# Altium project ecen303project.PrjPCB
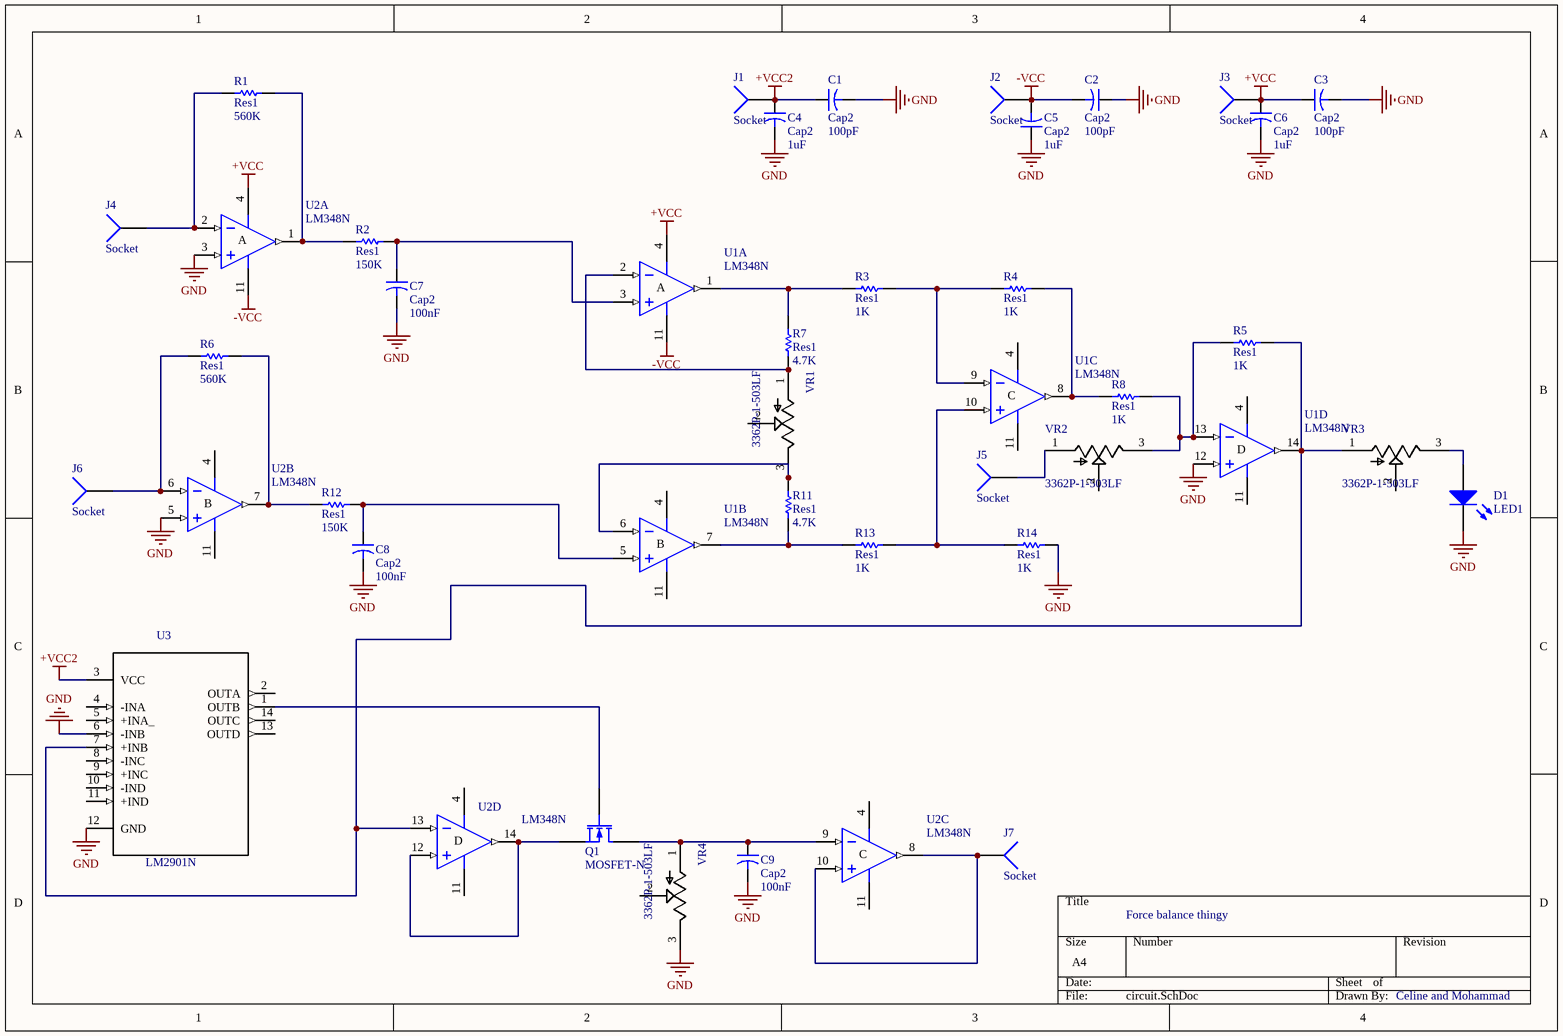
[diagram p0: circuit.SchDoc]
1 sheet, 37 parts. Net scope: global (net labels, ports and power ports of the same name join across sheets).
Board file: PCB.PcbDoc

## Sheet circuit.SchDoc
size A4

### Parts
C1  Cap2  value 100pF  [CAPR5-4X5]
C2  Cap2  value 100pF  [CAPR5-4X5]
C3  Cap2  value 100pF  [CAPR5-4X5]
C4  Cap2  value 1uF  [CAPR5-4X5]
C5  Cap2  value 1uF  [CAPR5-4X5]
C6  Cap2  value 1uF  [CAPR5-4X5]
C7  Cap2  value 100nF  [CAPR5-4X5]
C8  Cap2  value 100nF  [CAPR5-4X5]
C9  Cap2  value 100nF  [CAPR5-4X5]
D1  LED1  [LED-1]
J1  Socket  [PIN1]
J2  Socket  [PIN1]
J3  Socket  [PIN1]
J4  Socket  [PIN1]
J5  Socket  [PIN1]
J6  Socket  [PIN1]
J7  Socket  [PIN1]
Q1  MOSFET-N  [E3]
R1  Res1  value 560K  [AXIAL-0.3]
R2  Res1  value 150K  [AXIAL-0.3]
R3  Res1  value 1K  [AXIAL-0.3]
R4  Res1  value 1K  [AXIAL-0.3]
R5  Res1  value 1K  [AXIAL-0.3]
R6  Res1  value 560K  [AXIAL-0.3]
R7  Res1  value 4.7K  [AXIAL-0.3]
R8  Res1  value 1K  [AXIAL-0.3]
R11  Res1  value 4.7K  [AXIAL-0.3]
R12  Res1  value 150K  [AXIAL-0.3]
R13  Res1  value 1K  [AXIAL-0.3]
R14  Res1  value 1K  [AXIAL-0.3]
U1  LM348N  [N014]  (parts A,B,C,D of 4)
U2  LM348N  [N014]  (parts A,B,C,D of 4)
U3  LM2901N  [*DIP254P762X508-14]
VR1  3362P-1-503LF  [*TRIM_3362P-1-503LF]
VR2  3362P-1-503LF  [*TRIM_3362P-1-503LF]
VR3  3362P-1-503LF  [*TRIM_3362P-1-503LF]
VR4  3362P-1-503LF  [*TRIM_3362P-1-503LF]

### Nets
+VCC: C3.1 C6.1 J3.1 U1.4(V+) U2.4(V+)
+VCC2: C1.1 C4.1 J1.1 U3.3(VCC)
-VCC: C2.2 C5.2 J2.1 U1.11(V-) U2.11(V-)
GND: C1.2 C2.1 C3.2 C4.2 C5.1 C6.2 C7.2 C8.2 C9.2 D1.2(K) R14.2 U1.12(IN+) U2.3(IN+) U2.5(IN+) U3.6(-INB) U3.12(GND) VR4.3(CW)
NetC7_1: C7.1 R2.2 U1.3(IN+)
NetC8_1: C8.1 R12.2 U1.5(IN+)
NetC9_1: C9.1 Q1.1(D) U2.9(IN-) VR4.1(CCW)
NetD1_1: D1.1(A) VR3.3(CW)
NetJ4_1: J4.1 R1.1 U2.2(IN-)
NetJ5_1: J5.1 VR2.1(CCW)
NetJ6_1: J6.1 R6.1 U2.6(IN-)
NetJ7_1: J7.1 U2.8(OUT) U2.10(IN+)
NetQ1_2: Q1.2(G) U3.1(OUTB)
NetQ1_3: Q1.3(S) U2.12(IN+) U2.14(OUT)
NetR1_2: R1.2 R2.1 U2.1(OUT)
NetR3_1: R3.1 R7.2 U1.1(OUT)
NetR3_2: R3.2 R4.1 U1.9(IN-)
NetR4_2: R4.2 R8.1 U1.8(OUT)
NetR5_1: R5.1 R8.2 U1.13(IN-) VR2.3(CW)
NetR5_2: R5.2 U1.14(OUT) U2.13(IN-) U3.7(+INB) VR3.1(CCW)
NetR6_2: R6.2 R12.1 U2.7(OUT)
NetR7_1: R7.1 U1.2(IN-) VR1.1(CCW)
NetR11_1: R11.1 R13.1 U1.7(OUT)
NetR11_2: R11.2 U1.6(IN-) VR1.3(CW)
NetR13_2: R13.2 R14.1 U1.10(IN+)

Not connected (* = marked no-connect by the designer): U3 2(OUTA) 4(-INA) 5(+INA_) 8(-INC) 9(+INC) 10(-IND) 11(+IND) 13(OUTD) 14(OUTC); VR1 2(WIPER); VR2 2(WIPER); VR3 2(WIPER); VR4 2(WIPER)

### Notes on the sheet
- Force balance thingy
- Celine and Mohammad
- (in symbol LM348N, part A) A
- (in symbol LM348N, part B) B
- (in symbol LM348N, part C) C
- (in symbol LM348N, part D) D

### Library data of the parts
C1-C9 = Cap2: Capacitor; Published: 23-Sep-2002; PackageReference: CAPR5-4X5; Publisher: Altium Limited; PackageDescription: Capacitor; 2 Leads
D1 = LED1: Typical RED GaAs LED; Published: 8-Jun-2000; LatestRevisionDate: 08-Jul-2005; LatestRevisionNote: Mech Layer 1 removed.; PackageReference: LED-1; Publisher: Altium Limited; PackageDescription: LED; 2 Leads
Q1 = MOSFET-N: N-Channel MOSFET; Published: 8-Jun-2000; LatestRevisionDate: 17-Jul-2002; LatestRevisionNote: Re-released for DXP Platform.; PackageVersion: 1995/1996; PackageReference: E3; Publisher: Altium Limited; PackageDescription: TO, Flat Index; 3 In-Line, Axial Leads; Body Dia. 4.6mm; Lead Dia. 0.5 mm (max)
R1-R8 R11-R14 = Res1: Resistor; Published: 8-Jun-2000; LatestRevisionDate: 17-Jul-2002; LatestRevisionNote: Re-released for DXP Platform.; PackageReference: AXIAL-0.3; Publisher: Altium Limited; PackageDescription: Axial Device, Thru-Hole; 2 Leads; 0.3 in Pin Spacing
U1 U2 = LM348N: Quadruple Operational Amplifier; Published: 16-Jan-2001; LatestRevisionDate: 04-Mar-2005; LatestRevisionNote: Stylized 3D Model Added.; DatasheetVersion: Aug-1996; PackageVersion: Oct-1995; PackageReference: N014; Publisher: Altium Limited; PackageDescription: DIP; 14 Leads; Row Spacing 7.62 mm; Pitch 2.54 mm; ComponentLink1Description: Manufacturer Link; ComponentLink1URL: http://www.ti.com/; ComponentLink2Description: Datasheet; ComponentLink2URL: http://www-s.ti.com/sc/ds/lm348.pdf
U3 = LM2901N: Low Power Low Offset Voltage Quad Comparator 14-PDIP -40 to 85; MF: Texas Instruments; MP: LM2901N/NOPB; Price: None; Package: PDIP-14 Texas Instruments; SnapEDA_Link: https://www.snapeda.com/parts/LM2901N/NOPB/Texas%20Instruments/view-part/?ref=snap; Availability: Unavailable; Value: *
VR1-VR4 = 3362P-1-503LF: Res Cermet Trimmer 50K Ohm 10% 1/2W 1_Elec_/1_Mech_Turn 2.77mm _6.6 X 6.99 X 4.7mm_ Pin Thru-Hole Tube; MF: Bourns; SnapEDA_Link: https://www.snapeda.com/parts/3362P-1-503LF/Bourns%20-%20J.W.%20Miller/view-part/?ref=snap; Digi-Key_Part_Number: 3362P-503LF-ND; MP: 3362P-1-503LF; Package: Bourns; Digi-Key_Purchase_URL: https://www.digikey.co.nz/product-detail/en/bourns-inc/3362P-1-503LF/3362P-503LF-ND/1003342?utm_source=snapeda&utm_medium=aggregator&utm_campaign=symbol; Value: *
J1-J7 = Socket: LatestRevisionDate: 17-Jul-2002; LatestRevisionNote: Re-released for DXP Platform.; Publisher: Altium Limited